# Altium schematic sheet MCU_GPIO.SchDoc: MCU GPIO
size A4; Revision: 1.0; SheetNumber: 5; SheetTotal: 11; Class: B
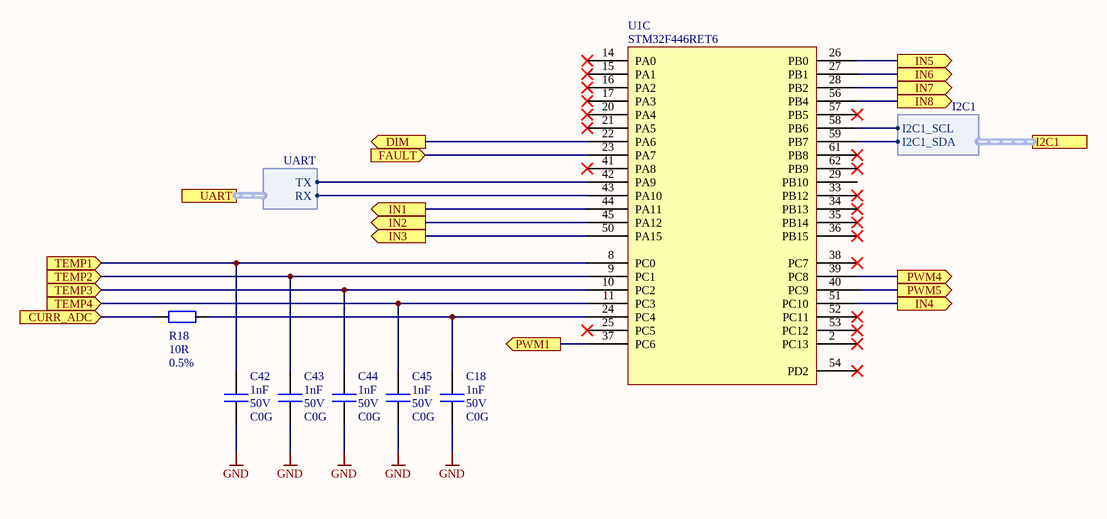
[diagram p0: MCU_GPIO.SchDoc]

## Parts
C18  value 1nF  Voltage: 50V  Dielectric: C0G  [C_0603]  (hidden comment: C)
C42  value 1nF  Voltage: 50V  Dielectric: C0G  [C_0603]  (hidden comment: C)
C43  value 1nF  Voltage: 50V  Dielectric: C0G  [C_0603]  (hidden comment: C)
C44  value 1nF  Voltage: 50V  Dielectric: C0G  [C_0603]  (hidden comment: C)
C45  value 1nF  Voltage: 50V  Dielectric: C0G  [C_0603]  (hidden comment: C)
R18  value 10R  Tolerance: 0.5%  [R_0603]  (hidden comment: R)
U1  value STM32F446RET6  [LQFP64]  (hidden comment: MCU_STM32F446RET6)  (part C of 3)

## Ports
CURR_ADC (in), DIM (out), FAULT (in), I2C1 (harness I2C1), IN1 (out), IN2 (out), IN3 (out), IN4 (out), IN5 (out), IN6 (out), IN7 (out), IN8 (out), PWM1 (out), PWM4 (out), PWM5 (out), TEMP1 (in), TEMP2 (in), TEMP3 (in), TEMP4 (in), UART (harness UART)

## Harnesses
UART: TX, RX
I2C1: I2C1_SCL, I2C1_SDA

## Nets
GND: C18.2 C42.2 C43.2 C44.2 C45.2
CURR_ADC: R18.1 ; port CURR_ADC
DIM: U1.22(PA6) ; port DIM
FAULT: U1.23(PA7) ; port FAULT
IN1: U1.44(PA11) ; port IN1
IN2: U1.45(PA12) ; port IN2
IN3: U1.50(PA15) ; port IN3
IN4: U1.51(PC10) ; port IN4
IN5: U1.26(PB0) ; port IN5
IN6: U1.27(PB1) ; port IN6
IN7: U1.28(PB2) ; port IN7
IN8: U1.56(PB4) ; port IN8
PWM1: U1.37(PC6) ; port PWM1
PWM4: U1.39(PC8) ; port PWM4
PWM5: U1.40(PC9) ; port PWM5
TEMP1: C42.1 U1.8(PC0) ; port TEMP1
TEMP2: C43.1 U1.9(PC1) ; port TEMP2
TEMP3: C44.1 U1.10(PC2) ; port TEMP3
TEMP4: C45.1 U1.11(PC3) ; port TEMP4
NetC18_1: C18.1 R18.2 U1.24(PC4)
NetU1_42: U1.42(PA9) ; port UART.TX
NetU1_43: U1.43(PA10) ; port UART.RX
NetU1_58: U1.58(PB6) ; port I2C1.I2C1_SCL
NetU1_59: U1.59(PB7) ; port I2C1.I2C1_SDA

Not connected (* = marked no-connect by the designer): U1 2(PC13)* 14(PA0)* 15(PA1)* 16(PA2)* 17(PA3)* 20(PA4)* 21(PA5)* 25(PC5)* 29(PB10) 33(PB12)* 34(PB13)* 35(PB14)* 36(PB15)* 38(PC7)* 41(PA8)* 52(PC11)* 53(PC12)* 54(PD2)* 57(PB5)* 61(PB8)* 62(PB9)*

## Notes on the sheet
- Title:
- Date:
- Revision:
- Class:
- Sheet
- of

## Library data of the parts
C18 C42-C45 = C_1nF_50V_0603: Capacitor; Manufacturer: Kemet; Manufacturer Part Number: C0603T102J5GAC7867; Tmax: 125; Tmin: -55; Grade: 2; Fail Rate: A; Tolerance: 5%; Part Number: C_1nF_50V_0603; HelpURL: https://content.kemet.com/datasheets/KEM_C1026_C0G_COTS_SMD.pdf; Supplier 1: Digi-Key; Supplier Part Number 1: 399-20423-1-ND; Status: Active
R18 = R_10R_75V_0603: Manufacturer: Vishay; Manufacturer Part Number: MCT0603PD1009DP500; Voltage: 75V; RMS Power: 0.25W; TCR: 25ppm; Tmax: 175; Tmin: -55; Grade: 2; Part Number: R_10R_75V_0603; HelpURL: https://www.vishay.com/docs/28916/mcxhp.pdf; Supplier 2: Mouser; Supplier Part Number 2: 594-MCT0603PD1009DP5; Supplier 1: Digi-Key; Supplier Part Number 1: 749-1520-1-ND; Status: Active
U1 = STM32F446RET6: ARM Microcontroller, Cortex-M4 core; Manufacturer: St; Tmax: 85; Tmin: -40; Grade: 3; Part Number: STM32F446RET6; HelpURL: https://www.st.com/content/ccc/resource/technical/document/datasheet/65/cb/75/50/53/d6/48/24/DM00141306.pdf/files/DM00141306.pdf/jcr:content/translations/en.DM00141306.pdf; Manufacturer Part Number: STM32F446RET6; Supplier 1: Mouser; Supplier Part Number 1: 511-STM32F446RET6; Status: Active